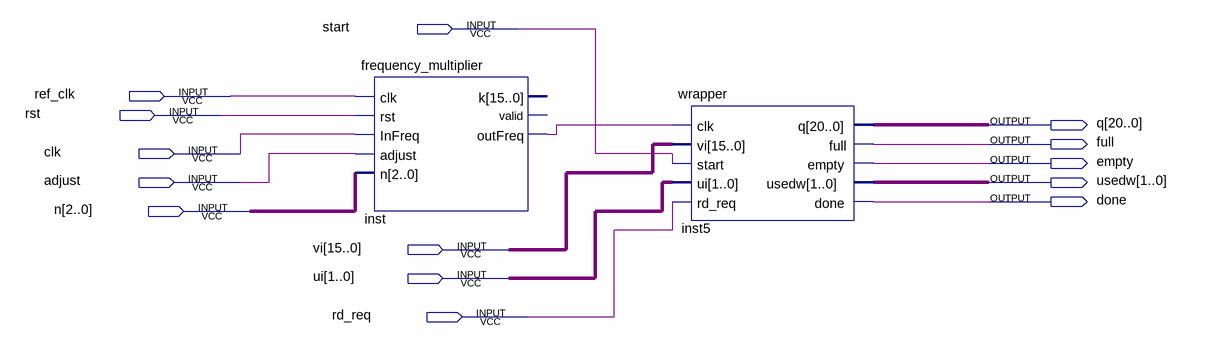
[diagram p0: schematic sheet]
// Quartus schematic integrated.bdf as structural Verilog: 2 symbols, 14 pins
module integrated (
  input  start,
  input  ref_clk,
  input  rst,
  input  clk,
  input  adjust,
  input  [2:0] n,
  input  [15:0] vi,
  input  [1:0] ui,
  input  rd_req,
  output [20:0] q,
  output full,
  output empty,
  output [1:0] usedw,
  output done
);

  wire inst_outfreq;

  frequency_multiplier inst (
    .clk(ref_clk), .rst(rst), .InFreq(clk), .adjust(adjust), .n(n), .outFreq(inst_outfreq));  // open: k, valid
  wrapper inst5 (
    .clk(inst_outfreq), .vi(vi), .start(start), .ui(ui), .rd_req(rd_req), .q(q), .full(full), .empty(empty),
    .usedw(usedw), .done(done));
endmodule
